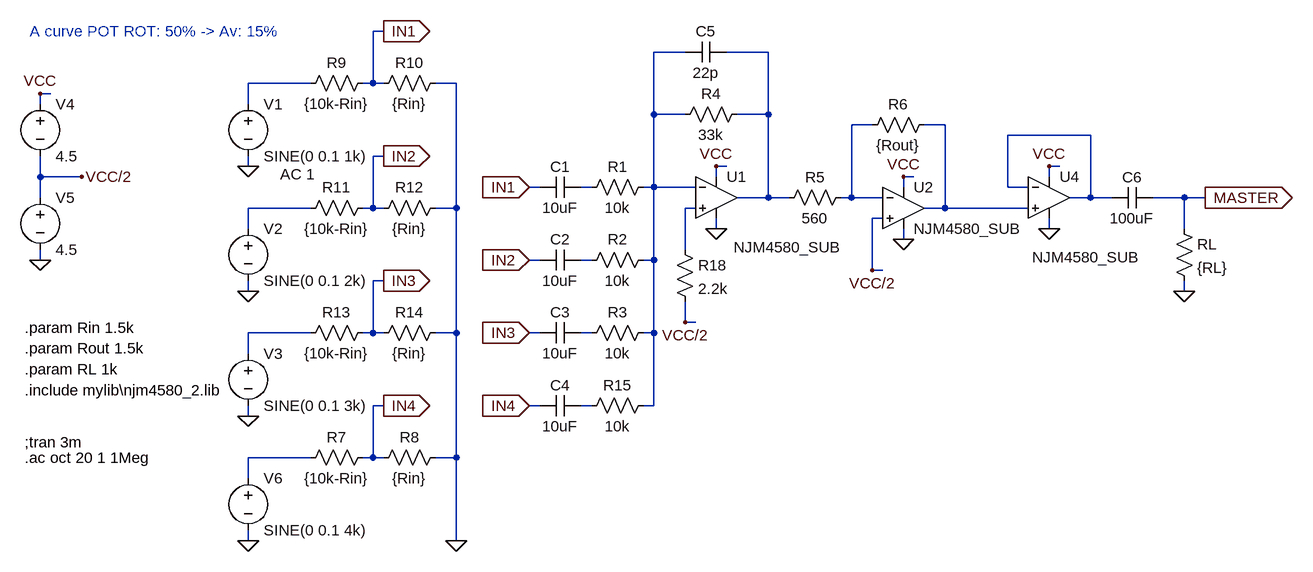
[diagram p0: schematic MIX0401.asc]
MIX0401.asc, the LTspice schematic file:
Version 4
SHEET 1 1244 748
WIRE -272 -80 -288 -80
WIRE 192 -48 144 -48
WIRE 320 -48 256 -48
WIRE -384 0 -480 0
WIRE -288 0 -288 -80
WIRE -288 0 -304 0
WIRE -272 0 -288 0
WIRE -160 0 -192 0
WIRE -784 16 -800 16
WIRE -800 32 -800 16
WIRE -480 32 -480 0
WIRE 144 48 144 -48
WIRE 192 48 144 48
WIRE 320 48 320 -48
WIRE 320 48 272 48
WIRE 480 64 448 64
WIRE 592 64 560 64
WIRE 816 80 688 80
WIRE -272 112 -288 112
WIRE -480 128 -480 112
WIRE 256 128 240 128
WIRE 768 128 752 128
WIRE -800 144 -800 112
WIRE -736 144 -800 144
WIRE 240 144 240 128
WIRE 544 144 528 144
WIRE 752 144 752 128
WIRE -32 160 -48 160
WIRE 48 160 32 160
WIRE 144 160 144 48
WIRE 144 160 128 160
WIRE 208 160 144 160
WIRE 528 160 528 144
WIRE 688 160 688 80
WIRE 720 160 688 160
WIRE -800 176 -800 144
WIRE 320 176 320 48
WIRE 320 176 272 176
WIRE 352 176 320 176
WIRE 448 176 448 64
WIRE 448 176 432 176
WIRE 496 176 448 176
WIRE 816 176 816 80
WIRE 816 176 784 176
WIRE 848 176 816 176
WIRE 960 176 912 176
WIRE 992 176 960 176
WIRE -384 192 -480 192
WIRE -288 192 -288 112
WIRE -288 192 -304 192
WIRE -272 192 -288 192
WIRE -160 192 -160 0
WIRE -160 192 -192 192
WIRE 208 192 192 192
WIRE 592 192 592 64
WIRE 592 192 560 192
WIRE 720 192 592 192
WIRE 496 208 480 208
WIRE -480 224 -480 192
WIRE 240 224 240 208
WIRE 752 224 752 208
WIRE 960 224 960 176
WIRE 528 240 528 224
WIRE 192 256 192 192
WIRE -800 272 -800 256
WIRE -32 272 -48 272
WIRE 48 272 32 272
WIRE 144 272 144 160
WIRE 144 272 128 272
WIRE 480 288 480 208
WIRE 496 288 480 288
WIRE -272 304 -288 304
WIRE -480 320 -480 304
WIRE 960 320 960 304
WIRE 192 368 192 336
WIRE 208 368 192 368
WIRE -384 384 -480 384
WIRE -288 384 -288 304
WIRE -288 384 -304 384
WIRE -272 384 -288 384
WIRE -160 384 -160 192
WIRE -160 384 -192 384
WIRE -32 384 -48 384
WIRE 48 384 32 384
WIRE 144 384 144 272
WIRE 144 384 128 384
WIRE -480 416 -480 384
WIRE -272 496 -288 496
WIRE -32 496 -48 496
WIRE 48 496 32 496
WIRE 144 496 144 384
WIRE 144 496 128 496
WIRE -480 512 -480 496
WIRE -384 576 -480 576
WIRE -288 576 -288 496
WIRE -288 576 -304 576
WIRE -272 576 -288 576
WIRE -160 576 -160 384
WIRE -160 576 -192 576
WIRE -480 608 -480 576
WIRE -480 704 -480 688
WIRE -160 704 -160 576
FLAG 240 128 VCC
FLAG -48 160 IN1
IOPIN -48 160 In
FLAG -48 272 IN2
IOPIN -48 272 In
FLAG -48 384 IN3
IOPIN -48 384 In
FLAG 992 176 MASTER
IOPIN 992 176 Out
FLAG -272 -80 IN1
IOPIN -272 -80 Out
FLAG -800 272 0
FLAG -800 16 VCC
FLAG 528 144 VCC
FLAG -272 112 IN2
IOPIN -272 112 Out
FLAG -272 304 IN3
IOPIN -272 304 Out
FLAG -272 496 IN4
IOPIN -272 496 Out
FLAG -48 496 IN4
IOPIN -48 496 In
FLAG 752 128 VCC
FLAG -736 144 VCC/2
FLAG -480 128 0
FLAG -480 320 0
FLAG -480 512 0
FLAG -480 704 0
FLAG -160 704 0
FLAG 192 368 VCC/2
FLAG 480 288 VCC/2
FLAG 240 224 0
FLAG 528 240 0
FLAG 752 224 0
FLAG 960 320 0
SYMBOL res 144 144 R90
WINDOW 0 0 56 VBottom 2
WINDOW 3 32 56 VTop 2
SYMATTR InstName R1
SYMATTR Value 10k
SYMBOL res 144 256 R90
WINDOW 0 0 56 VBottom 2
WINDOW 3 32 56 VTop 2
SYMATTR InstName R2
SYMATTR Value 10k
SYMBOL res 144 368 R90
WINDOW 0 0 56 VBottom 2
WINDOW 3 32 56 VTop 2
SYMATTR InstName R3
SYMATTR Value 10k
SYMBOL res 288 32 R90
WINDOW 0 0 56 VBottom 2
WINDOW 3 32 56 VTop 2
SYMATTR InstName R4
SYMATTR Value 33k
SYMBOL cap 32 144 R90
WINDOW 0 0 32 VBottom 2
WINDOW 3 32 32 VTop 2
SYMATTR InstName C1
SYMATTR Value 10uF
SYMBOL cap 32 256 R90
WINDOW 0 0 32 VBottom 2
WINDOW 3 32 32 VTop 2
SYMATTR InstName C2
SYMATTR Value 10uF
SYMBOL cap 32 368 R90
WINDOW 0 0 32 VBottom 2
WINDOW 3 32 32 VTop 2
SYMATTR InstName C3
SYMATTR Value 10uF
SYMBOL voltage -480 16 R0
WINDOW 123 49 124 Left 2
WINDOW 39 0 0 Left 2
SYMATTR Value2 AC 1
SYMATTR InstName V1
SYMATTR Value SINE(0 0.1 1k)
SYMBOL voltage -480 208 R0
WINDOW 123 0 0 Left 2
WINDOW 39 0 0 Left 2
SYMATTR InstName V2
SYMATTR Value SINE(0 0.1 2k)
SYMBOL voltage -480 400 R0
WINDOW 123 0 0 Left 2
WINDOW 39 0 0 Left 2
SYMATTR InstName V3
SYMATTR Value SINE(0 0.1 3k)
SYMBOL voltage -800 16 R0
WINDOW 123 0 0 Left 2
WINDOW 39 0 0 Left 2
SYMATTR InstName V4
SYMATTR Value 4.5
SYMBOL voltage -800 160 R0
WINDOW 123 0 0 Left 2
WINDOW 39 0 0 Left 2
SYMATTR InstName V5
SYMATTR Value 4.5
SYMBOL res 448 160 R90
WINDOW 0 0 56 VBottom 2
WINDOW 3 32 56 VTop 2
SYMATTR InstName R5
SYMATTR Value 560
SYMBOL res 576 48 R90
WINDOW 0 0 56 VBottom 2
WINDOW 3 32 56 VTop 2
SYMATTR InstName R6
SYMATTR Value {Rout}
SYMBOL res -288 -16 R90
WINDOW 0 0 56 VBottom 2
WINDOW 3 32 56 VTop 2
SYMATTR InstName R9
SYMATTR Value {10k-Rin}
SYMBOL res -176 -16 R90
WINDOW 0 0 56 VBottom 2
WINDOW 3 32 56 VTop 2
SYMATTR InstName R10
SYMATTR Value {Rin}
SYMBOL res -288 176 R90
WINDOW 0 0 56 VBottom 2
WINDOW 3 32 56 VTop 2
SYMATTR InstName R11
SYMATTR Value {10k-Rin}
SYMBOL res -176 176 R90
WINDOW 0 0 56 VBottom 2
WINDOW 3 32 56 VTop 2
SYMATTR InstName R12
SYMATTR Value {Rin}
SYMBOL res -288 368 R90
WINDOW 0 0 56 VBottom 2
WINDOW 3 32 56 VTop 2
SYMATTR InstName R13
SYMATTR Value {10k-Rin}
SYMBOL res -176 368 R90
WINDOW 0 0 56 VBottom 2
WINDOW 3 32 56 VTop 2
SYMATTR InstName R14
SYMATTR Value {Rin}
SYMBOL res 944 208 R0
SYMATTR InstName RL
SYMATTR Value {RL}
SYMBOL voltage -480 592 R0
WINDOW 123 0 0 Left 2
WINDOW 39 0 0 Left 2
SYMATTR InstName V6
SYMATTR Value SINE(0 0.1 4k)
SYMBOL res -288 560 R90
WINDOW 0 0 56 VBottom 2
WINDOW 3 32 56 VTop 2
SYMATTR InstName R7
SYMATTR Value {10k-Rin}
SYMBOL res -176 560 R90
WINDOW 0 0 56 VBottom 2
WINDOW 3 32 56 VTop 2
SYMATTR InstName R8
SYMATTR Value {Rin}
SYMBOL res 144 480 R90
WINDOW 0 0 56 VBottom 2
WINDOW 3 32 56 VTop 2
SYMATTR InstName R15
SYMATTR Value 10k
SYMBOL cap 32 480 R90
WINDOW 0 0 32 VBottom 2
WINDOW 3 32 32 VTop 2
SYMATTR InstName C4
SYMATTR Value 10uF
SYMBOL res 176 240 R0
SYMATTR InstName R18
SYMATTR Value 2.2k
SYMBOL cap 256 -64 R90
WINDOW 0 0 32 VBottom 2
WINDOW 3 32 32 VTop 2
SYMATTR InstName C5
SYMATTR Value 22p
SYMBOL Opamps\\opamp2 240 112 R0
WINDOW 3 27 140 Left 2
SYMATTR Value NJM4580_SUB
SYMATTR InstName U1
SYMBOL Opamps\\opamp2 528 128 R0
SYMATTR InstName U2
SYMATTR Value NJM4580_SUB
SYMBOL Opamps\\opamp2 752 112 R0
WINDOW 3 -26 156 Left 2
SYMATTR Value NJM4580_SUB
SYMATTR InstName U4
SYMBOL cap 912 160 R90
WINDOW 0 0 32 VBottom 2
WINDOW 3 32 32 VTop 2
SYMATTR InstName C6
SYMATTR Value 100uF
TEXT -824 552 Left 2 !;tran 3m
TEXT -824 576 Left 2 !.ac oct 20 1 1Meg
TEXT -816 -80 Left 2 ;A curve POT ROT: 50% -> Av: 15%
TEXT -824 376 Left 2 !.param Rin 1.5k
TEXT -824 408 Left 2 !.param Rout 1.5k
TEXT -824 440 Left 2 !.param RL 1k
TEXT -824 472 Left 2 !.include mylib\\njm4580_2.lib

The netlist it stands for:
* MIX0401.asc
R1 N001 N007 10k
R2 N001 N010 10k
R3 N001 N012 10k
R4 N002 N001 33k
C1 N007 IN1 10uF
C2 N010 IN2 10uF
C3 N012 IN3 10uF
V1 N003 0 SINE(0 0.1 1k) AC 1
V2 N008 0 SINE(0 0.1 2k)
V3 N011 0 SINE(0 0.1 3k)
V4 VCC VCC/2 4.5
V5 VCC/2 0 4.5
R5 N004 N002 560
R6 N005 N004 {Rout}
R9 IN1 N003 {10k-Rin}
R10 0 IN1 {Rin}
R11 IN2 N008 {10k-Rin}
R12 0 IN2 {Rin}
R13 IN3 N011 {10k-Rin}
R14 0 IN3 {Rin}
RL MASTER 0 {RL}
V6 N014 0 SINE(0 0.1 4k)
R7 IN4 N014 {10k-Rin}
R8 0 IN4 {Rin}
R15 N001 N013 10k
C4 N013 IN4 10uF
R18 N009 VCC/2 2.2k
C5 N002 N001 22p
XU1 N009 N001 VCC 0 N002 NJM4580_SUB  ; pins In+ In- V+ V- OUT
XU2 VCC/2 N004 VCC 0 N005 NJM4580_SUB  ; pins In+ In- V+ V- OUT
XU4 N005 N006 VCC 0 N006 NJM4580_SUB  ; pins In+ In- V+ V- OUT
C6 MASTER N006 100uF
;tran 3m
.ac oct 20 1 1Meg
* A curve POT ROT: 50% -> Av: 15%
.param Rin 1.5k
.param Rout 1.5k
.param RL 1k
.include mylib\njm4580_2.lib
.backanno
.end